# EAGLE schematic pd2 (EAGLE 9.1.0)
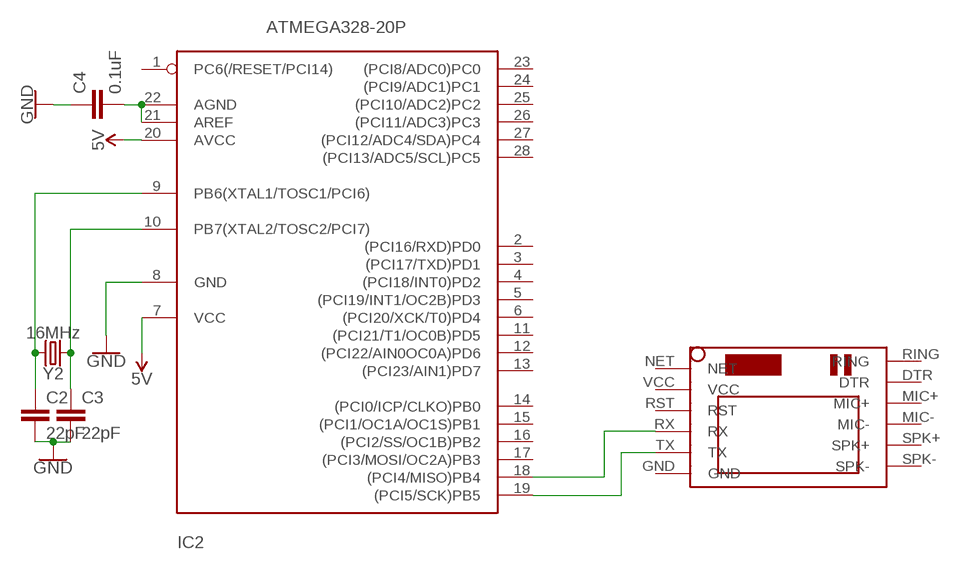
[diagram p0: schematic, sheet 1]

## Parts
C2  22pF  22PF-0603-50V-5%  [0603]
C3  22pF  22PF-0603-50V-5%  [0603]
C4  0.1uF  0.1UF-0402-16V-10%  [0402]
IC2  ATMEGA328-20P  [DIL28-3]
U$1  SIM800LMODULE  [SIM800LMODULE]
Y2  16MHz  CRYSTAL-16MHZPTH-HC49US  [HC49US]

## Nets
5V: IC2.7(VCC) IC2.20(AVCC)
GND: C2.2 C3.2 C4.1 IC2.8(GND)
N$1: IC2.19((PCI5/SCK)PB5) U$1.TX
N$2: IC2.18((PCI4/MISO)PB4) U$1.RX
N$11: C4.2 IC2.21(AREF) IC2.22(AGND)
N$43: C3.1 IC2.10(PB7(XTAL2/TOSC2/PCI7)) Y2.1
N$45: C2.1 IC2.9(PB6(XTAL1/TOSC1/PCI6)) Y2.2
Unconnected: IC2.1(PC6(/RESET/PCI14)) IC2.2((PCI16/RXD)PD0) IC2.3((PCI17/TXD)PD1) IC2.4((PCI18/INT0)PD2) IC2.5((PCI19/INT1/OC2B)PD3) IC2.6((PCI20/XCK/T0)PD4) IC2.11((PCI21/T1/OC0B)PD5) IC2.12((PCI22/AIN0OC0A)PD6) IC2.13((PCI23/AIN1)PD7) IC2.14((PCI0/ICP/CLKO)PB0) IC2.15((PCI1/OC1A/OC1S)PB1) IC2.16((PCI2/SS/OC1B)PB2) IC2.17((PCI3/MOSI/OC2A)PB3) IC2.23((PCI8/ADC0)PC0) IC2.24((PCI9/ADC1)PC1) IC2.25((PCI10/ADC2)PC2) IC2.26((PCI11/ADC3)PC3) IC2.27((PCI12/ADC4/SDA)PC4) IC2.28((PCI13/ADC5/SCL)PC5) U$1.DTR U$1.GND U$1.MIC+ U$1.MIC- U$1.NET U$1.RING U$1.RST U$1.SPK+ U$1.SPK- U$1.VCC

## Library data of the parts
C2 C3 = SparkFun-Capacitors:22PF: 22pF ceramic capacitors A capacitor is a passive two-terminal electrical component used to store electrical energy temporarily in an electric field.; PROD_ID: CAP-07876
C4 = SparkFun-Capacitors:0.1UF: 0.1µF ceramic capacitors A capacitor is a passive two-terminal electrical component used to store electrical energy temporarily in an electric field.; PROD_ID: CAP-12416
IC2 = atmega328:ATMEGA328*P: MICROCONTROLLER 32 kBytes FLASH 2 kBytes SRAM 1 kBytes EEPROM USART 8-channel 10 bit ADC
U$1 = SIM800LMODULE:SIM800LMODULE: SIM800L Module
Y2 = SparkFun-Clocks:CRYSTAL-16MHZ: 16MHz Crystal Digikey Example <http://www.digikey.com/product-search/en?keywords=535-9122-1-ND> Frequency: 16MHz Frequency Stability: ±50ppm Frequency Tolerance: ±20ppm Load Capacitance: 18pF SparkFun Products: Pro Micro -5V/16MHz <https://www.sparkfun.com/products/12640> SparkFun Serial Enabled LCD Kit <https://www.sparkfun.com/products/10097>; PROD_ID: XTAL-08181; SF_ID: COM-00536